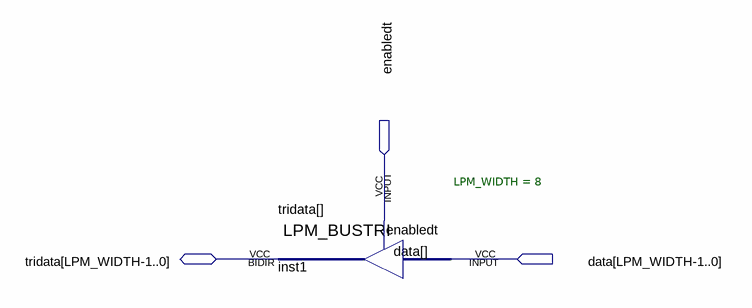
[diagram p0: schematic sheet]
// Quartus schematic bustri.bdf as structural Verilog: 1 symbols, 3 pins
module bustri (
  input  enabledt,
  input  \data[LPM_WIDTH-1..0] ,
  inout  \tridata[LPM_WIDTH-1..0] 
);

  LPM_BUSTRI #(.LPM_WIDTH(8)) inst1 (
    .data({8{\data[LPM_WIDTH-1..0] }}), .enabledt(enabledt), .tridata(\tridata[LPM_WIDTH-1..0] ));
endmodule
